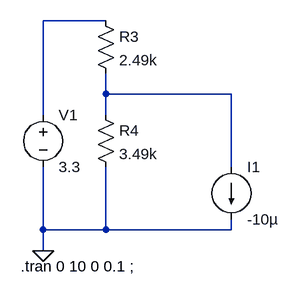
[diagram p0: schematic bias_circuit.asc]
bias_circuit.asc, the LTspice schematic file:
Version 4
SHEET 1 880 680
WIRE 112 -64 16 -64
WIRE 112 48 112 16
WIRE 304 48 112 48
WIRE 16 80 16 -64
WIRE 112 80 112 48
WIRE 304 160 304 48
WIRE 16 256 16 160
WIRE 112 256 112 160
WIRE 112 256 16 256
WIRE 304 256 304 240
WIRE 304 256 112 256
WIRE 16 288 16 256
FLAG 16 288 0
SYMBOL voltage 16 64 R0
WINDOW 123 0 0 Left 0
WINDOW 39 0 0 Left 0
SYMATTR InstName V1
SYMATTR Value 3.3
SYMBOL current 304 160 R0
WINDOW 123 0 0 Left 0
WINDOW 39 0 0 Left 0
SYMATTR InstName I1
SYMATTR Value -10µ
SYMBOL res 96 -80 R0
SYMATTR InstName R3
SYMATTR Value 2.49k
SYMBOL res 96 64 R0
SYMATTR InstName R4
SYMATTR Value 3.49k
TEXT -18 312 Left 2 !.tran 0 10 0 0.1 ;

The netlist it stands for:
* bias_circuit.asc
V1 N001 0 3.3
I1 N002 0 -10µ
R3 N001 N002 2.49k
R4 N002 0 3.49k
.tran 0 10 0 0.1 ;
.backanno
.end